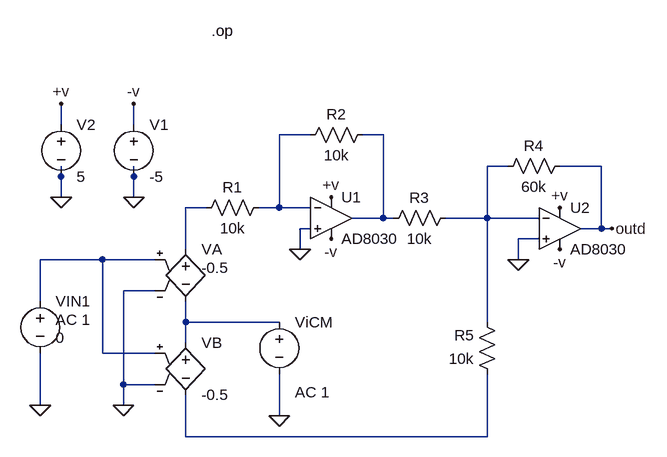
[diagram p0: schematic A0Instrumentatie_OP.asc]
A0Instrumentatie_OP.asc, the LTspice schematic file:
Version 4.1
SHEET 1 1660 1844
WIRE -464 16 -464 -16
WIRE -352 16 -352 -16
WIRE -80 32 -128 32
WIRE 32 32 0 32
WIRE 224 80 192 80
WIRE 368 80 304 80
WIRE -464 96 -464 80
WIRE -352 96 -352 80
WIRE -464 128 -464 96
WIRE -352 128 -352 96
WIRE -240 144 -272 144
WIRE -128 144 -128 32
WIRE -128 144 -160 144
WIRE -80 144 -128 144
WIRE 32 160 32 32
WIRE 32 160 -16 160
WIRE 48 160 32 160
WIRE 192 160 192 80
WIRE 192 160 128 160
WIRE 272 160 192 160
WIRE -80 176 -96 176
WIRE 368 176 368 80
WIRE 368 176 336 176
WIRE 384 176 368 176
WIRE 272 192 240 192
WIRE -272 208 -272 144
WIRE -96 208 -96 176
WIRE -400 224 -496 224
WIRE -320 224 -400 224
WIRE 240 224 240 192
WIRE -320 272 -368 272
WIRE -496 288 -496 224
WIRE -272 320 -272 288
WIRE -128 320 -272 320
WIRE 192 320 192 160
WIRE -272 352 -272 320
WIRE -400 368 -400 224
WIRE -320 368 -400 368
WIRE -368 416 -368 272
WIRE -320 416 -368 416
WIRE -496 448 -496 368
WIRE -368 448 -368 416
WIRE -128 464 -128 400
WIRE -272 496 -272 432
WIRE 192 496 192 400
WIRE 192 496 -272 496
FLAG 240 224 0
FLAG -96 208 0
FLAG -352 128 0
FLAG -464 128 0
FLAG -464 -16 +v
FLAG -352 -16 -v
FLAG -48 128 +v
FLAG 304 144 +v
FLAG -48 192 -v
FLAG 304 208 -v
FLAG 384 176 outd
FLAG -368 448 0
FLAG -496 448 0
FLAG -128 464 0
DATAFLAG -496 288 ""
DATAFLAG 368 80 ""
SYMBOL res -144 128 R90
WINDOW 0 0 56 VBottom 2
WINDOW 3 32 56 VTop 2
SYMATTR InstName R1
SYMATTR Value 10k
SYMBOL res 16 16 R90
WINDOW 0 0 56 VBottom 2
WINDOW 3 32 56 VTop 2
SYMATTR InstName R2
SYMATTR Value 10k
SYMBOL res 144 144 R90
WINDOW 0 0 56 VBottom 2
WINDOW 3 32 56 VTop 2
SYMATTR InstName R3
SYMATTR Value 10k
SYMBOL res 208 96 R270
WINDOW 0 32 56 VTop 2
WINDOW 3 0 56 VBottom 2
SYMATTR InstName R4
SYMATTR Value 60k
SYMBOL res 208 416 R180
WINDOW 0 36 76 Left 2
WINDOW 3 36 40 Left 2
SYMATTR InstName R5
SYMATTR Value 10k
SYMBOL voltage -464 0 R0
WINDOW 123 0 0 Left 0
WINDOW 39 0 0 Left 0
SYMATTR InstName V2
SYMATTR Value 5
SYMBOL voltage -352 0 R0
WINDOW 123 0 0 Left 0
WINDOW 39 0 0 Left 0
SYMATTR InstName V1
SYMATTR Value -5
SYMBOL voltage -496 272 R0
WINDOW 123 24 44 Left 2
WINDOW 39 0 0 Left 0
WINDOW 3 24 72 Left 2
SYMATTR Value2 AC 1
SYMATTR Value 0
SYMATTR InstName VIN1
SYMBOL e -272 336 R0
SYMATTR InstName VB
SYMATTR Value -0.5
SYMBOL e -272 192 R0
WINDOW 3 24 44 Left 2
SYMATTR Value -0.5
SYMATTR InstName VA
SYMBOL voltage -128 304 R0
WINDOW 123 24 124 Left 2
WINDOW 39 0 0 Left 0
SYMATTR Value2 AC 1
SYMATTR InstName ViCM
SYMATTR Value ""
SYMBOL OpAmps\\AD8030 -48 96 R0
SYMATTR InstName U1
SYMBOL OpAmps\\AD8030 304 112 R0
SYMATTR InstName U2
TEXT -232 -128 Left 2 !.op

The netlist it stands for:
* A0Instrumentatie_OP.asc
R1 N001 N004 10k
R2 N002 N001 10k
R3 N003 N002 10k
R4 N003 outd 60k
R5 N007 N003 10k
V2 +v 0 5
V1 -v 0 -5
VIN1 N005 0 0 AC 1
E§VB N006 N007 N005 0 -0.5
E§VA N004 N006 N005 0 -0.5
ViCM N006 0 AC 1
X§U1 0 N001 +v -v N002 AD8040  ; AD8030, pins In+ In- V+ V- OUT
X§U2 0 N003 +v -v outd AD8040  ; AD8030, pins In+ In- V+ V- OUT
.op
.lib ADI.lib
.backanno
.end